# EAGLE design Qwiic_IMU_Bonobo (EAGLE 7.7.0)
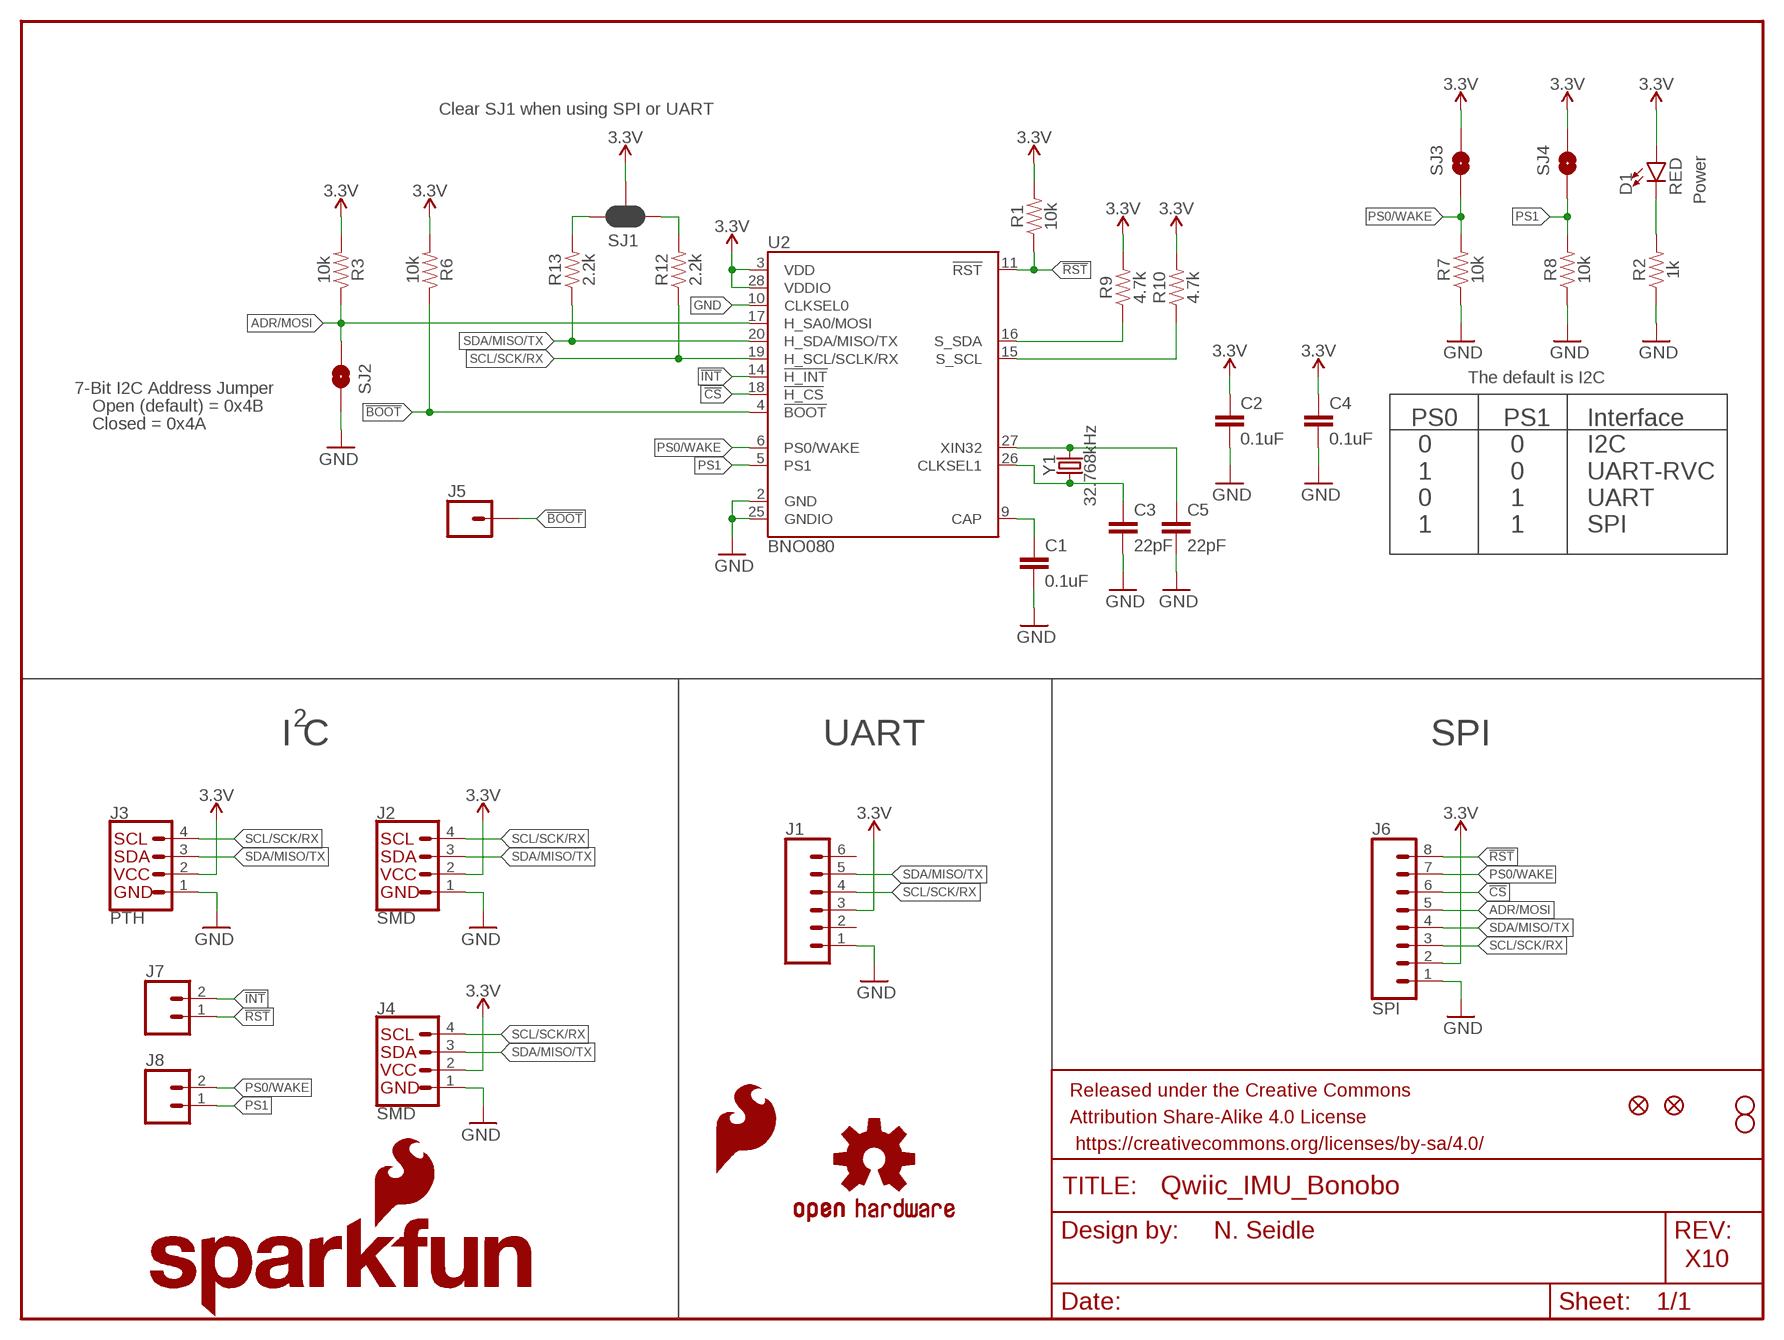
[diagram p0: schematic, sheet 1]

## Parts
C1  0.1uF  0.1UF-0603-25V-(+80/-20%)  [0603]
C2  0.1uF  0.1UF-0603-25V-(+80/-20%)  [0603]
C3  22pF  22PF-0603-50V-5%  [0603]
C4  0.1uF  0.1UF-0603-25V-(+80/-20%)  [0603]
C5  22pF  22PF-0603-50V-5%  [0603]
D1  RED  LED-RED0603  [LED-0603]
FRAME1  FRAME-LETTER  [CREATIVE_COMMONS]
J1  CONN_06NO_SILK_FEMALE_PTH  [1X06_NO_SILK]
J2  SMD  I2C_STANDARDJS-1MM  [1X04_1MM_RA]
J3  PTH  I2C_STANDARD_NO_SILK  [1X04_NO_SILK]
J4  SMD  I2C_STANDARDJS-1MM  [1X04_1MM_RA]
J5  CONN_01PTH_NO_SILK_YES_STOP  [1X01_NO_SILK]
J6  SPI  CONN_08NO_SILK_FEMALE_PTH  [1X08_NO_SILK]
J7  CONN_021X02_NO_SILK  [1X02_NO_SILK]
J8  CONN_021X02_NO_SILK  [1X02_NO_SILK]
JP2  FIDUCIALUFIDUCIAL  [MICRO-FIDUCIAL]
JP3  STAND-OFF  [STAND-OFF]
JP4  STAND-OFF  [STAND-OFF]
JP6  FIDUCIALUFIDUCIAL  [MICRO-FIDUCIAL]
LOGO1  OSHW-LOGOMINI  [OSHW-LOGO-MINI]
LOGO4  SFE_LOGO_FLAME.1_INCH  [SFE_LOGO_FLAME_.1]
LOGO5  SFE_LOGO_NAME_FLAME.1_INCH  [SFE_LOGO_NAME_FLAME_.1]
R1  10k  10KOHM-0603-1/10W-1%  [0603]
R2  1k  1KOHM-0603-1/10W-1%  [0603]
R3  10k  10KOHM-0603-1/10W-1%  [0603]
R6  10k  10KOHM-0603-1/10W-1%  [0603]
R7  10k  10KOHM-0603-1/10W-1%  [0603]
R8  10k  10KOHM-0603-1/10W-1%  [0603]
R9  4.7k  4.7KOHM-0603-1/10W-1%  [0603]
R10  4.7k  4.7KOHM-0603-1/10W-1%  [0603]
R12  2.2k  2.2KOHM-0603-1/10W-1%  [0603]
R13  2.2k  2.2KOHM-0603-1/10W-1%  [0603]
SJ1  JUMPER-SMT_3_2-NC_PASTE_SILK  [SMT-JUMPER_3_2-NC_PASTE_SILK]
SJ2  SOLDERJUMPERNO  [SJ_2S-NO]
SJ3  SOLDERJUMPERNO  [SJ_2S-NO]
SJ4  SOLDERJUMPERNO  [SJ_2S-NO]
U2  BNO080  [LGA-28]
Y1  32.768kHz  CRYSTAL-32.768KHZSMD-3.2X1.5  [CRYSTAL-SMD-3.2X1.5MM]

## Nets
3.3V: C2.1 C4.1 D1.A J1.3 J2.2(VCC) J3.2(VCC) J4.2(VCC) J6.2 R1.2 R3.2 R6.2 R9.2 R10.2 SJ1.2 SJ3.1 SJ4.1 U2.3(VDD) U2.28(VDDIO)
!BOOT: J5.1 R6.1 U2.4(!BOOT)
!CS: J6.6 U2.18(!H_CS)
!INT: J7.2 U2.14(!H_INT)
!RST: J6.8 J7.1 R1.1 U2.11(!RST)
ADR/MOSI: J6.5 R3.1 SJ2.2 U2.17(H_SA0/MOSI)
CAP: C1.1 U2.9(CAP)
GND: C1.2 C2.2 C3.2 C4.2 C5.2 J1.1 J2.1(GND) J3.1(GND) J4.1(GND) J6.1 R2.1 R7.1 R8.1 SJ2.1 U2.2(GND) U2.10(CLKSEL0) U2.25(GNDIO)
N$1: C5.1 U2.27(XIN32) Y1.P$2
N$2: C3.1 U2.26(CLKSEL1) Y1.P$1
N$3: D1.C R2.2
PS0/WAKE: J6.7 J8.2 R7.2 SJ3.2 U2.6(PS0/WAKE)
PS1: J8.1 R8.2 SJ4.2 U2.5(PS1)
S_SCL: R10.1 U2.15(S_SCL)
S_SDA: R9.1 U2.16(S_SDA)
SCL/SCK/RX: J1.4 J2.4(SCL) J3.4(SCL) J4.4(SCL) J6.3 R12.1 U2.19(H_SCL/SCLK/RX)
SCL_PU: R12.2 SJ1.1
SDA/MISO/TX: J1.5 J2.3(SDA) J3.3(SDA) J4.3(SDA) J6.4 R13.1 U2.20(H_SDA/MISO/TX)
SDA_PU: R13.2 SJ1.3
Unconnected: J1.2 J1.6

## Notes on the sheet
- Clear SJ1 when using SPI or UART
- Power
- The default is I2C
- 7-Bit I2C Address Jumper
- Open (default) = 0x4B
- Closed = 0x4A
- PS0
   0
   1
   0
   1
- PS1
   0
   0
   1
   1
- Interface
  I2C
  UART-RVC
  UART
  SPI
- 2
- I C | UART | SPI
- N. Seidle
- X10

## Library data of the parts
C1 C2 C4 = SparkFun-Capacitors:0.1UF: 0.1µF ceramic capacitors A capacitor is a passive two-terminal electrical component used to store electrical energy temporarily in an electric field.; PROD_ID: CAP-00810
C3 C5 = SparkFun-Capacitors:22PF: 22pF ceramic capacitors A capacitor is a passive two-terminal electrical component used to store electrical energy temporarily in an electric field.; PROD_ID: CAP-07876
D1 = SparkFun-LED:LED-RED: Red SMD LED Used in manufacturing of most products at SparkFun Packages: 0603 - SMD 0603 package [Product Link] <http://docs.avagotech.com/docs/AV02-0551EN> 0603 SMART - SMD 0603 SMART package ( more efficient and expensive)[Product Link] <http://www.osram-os.com/Graphics/XPic2/00077099_0.pdf> 1206 - SMD1206 package [Product Link] <https://www.sparkfun.com/datasheets/DevTools/LilyPad/Q150OVS4.pdff> SparkFun Products: Pro Mini 328 -5V <https://www.sparkfun.com/products/821> RedBoard <https://www.sparkfun.com/products/12757> IOIO-OTG <https://www.sparkfun.com/products/13613>; PROD_ID: DIO-00819
FRAME1 = SparkFun-Aesthetics:FRAME-LETTER: Schematic Frame - Letter Standard 8.5x11 US Letter frame
J1 = SparkFun-Connectors:CONN_06: Multi connection point. Often used as Generic Header-pin footprint for 0.1 inch spaced/style header connections On any of the 0.1 inch spaced packages, you can populate with these: Break Away Headers - Straight <https://www.sparkfun.com/products/116> (PRT-00116) Break Away Male Headers - Right Angle <https://www.sparkfun.com/products/553> (PRT-00553) Female Headers <https://www.sparkfun.com/products/115> (PRT-00115) Break Away Headers - Machine Pin <https://www.sparkfun.com/products/117> (PRT-00117) Break Away Female Headers - Swiss Machine Pin <https://www.sparkfun.com/products/743> (PRT-00743) Arduino Stackable Header - 6 Pin <https://www.sparkfun.com/products/9280> (PRT-09280) For SCREWTERMINALS and SPRING TERMINALS visit here: Screw Terimnals on SparkFun.com <https://www.sparkfun.com/search/results?term=Screw+Terminals> (5mm/3.5mm/2.54mm spacing) This device is also useful as a general connection point to wire up your design to another part of your project. Our various solder wires solder well into these plated through hole pads. Hook-Up Wire - Assortment (Stranded, 22 AWG) <https://www.sparkfun.com/products/11375> (PRT-11375) Hook-Up Wire - Assortment (Solid Core, 22 AWG) <https://www.sparkfun.com/products/11367> (PRT-11367) View the entire wire category on our website here <https://www.sparkfun.com/categories/141>; PROD_ID: CONN-08437
J2-J4 = SparkX:I2C_STANDARD: SparkFun I2C Standard Pinout Header SparkFun has standardized on a pinout for all I2C based sensor breakouts. This pinout allows I2C boards to be plugged directly into the headers on Arduino Uno compatible boards, and to be daisy chained easily. Example SparkFun Products: SparkFun Atmospheric Sensor Breakout - BME280 <https://www.sparkfun.com/products/13676> SparkFun Altitude/Pressure Sensor Breakout - MPL3115A2 <https://www.sparkfun.com/products/11084> SparkFun TOF Range Finder Sensor - VL6180 <https://www.sparkfun.com/products/12785>
J5 = SparkFun-Connectors:CONN_01: Single connection point. Often used as Generic Header-pin footprint for 0.1 inch spaced/style header connections On any of the 0.1 inch spaced packages, you can populate with these: Break Away Headers - Straight <https://www.sparkfun.com/products/116> (PRT-00116) Break Away Male Headers - Right Angle <https://www.sparkfun.com/products/553> (PRT-00553) Female Headers <https://www.sparkfun.com/products/115> (PRT-00115) Break Away Headers - Machine Pin <https://www.sparkfun.com/products/117> (PRT-00117) Break Away Female Headers - Swiss Machine Pin <https://www.sparkfun.com/products/743> (PRT-00743) This device is also useful as a general connection point to wire up your design to another part of your project. Our various solder wires solder well into these plated through hole pads. Hook-Up Wire - Assortment (Stranded, 22 AWG) <https://www.sparkfun.com/products/11375> (PRT-11375) Hook-Up Wire - Assortment (Solid Core, 22 AWG) <https://www.sparkfun.com/products/11367> (PRT-11367) View the entire wire category on our website here <https://www.sparkfun.com/categories/141> Special notes: SMTSO-256-ET is a "flush mount" nut for a 4-40 screw. We mostly use this on specialty testbeds; it is a nice way to connect hardware to your PCB at an adjustable hieght. Also note, the SNAP packages are for using a snappable style connector. We sell a baggie of snaps and they are also used on two LilyPad designs: Snap Assortment - 30 pack (male and female) <https://www.sparkfun.com/products/11347> (DEV-11347) LilyPad Arduino SimpleSnap <https://www.sparkfun.com/products/10941> (DEV-10941) LilyPad SimpleSnap Protoboard <https://www.sparkfun.com/products/10940> (DEV-10940)
J6 = SparkFun-Connectors:CONN_08: Multi connection point. Often used as Generic Header-pin footprint for 0.1 inch spaced/style header connections On any of the 0.1 inch spaced packages, you can populate with these: Break Away Headers - Straight <https://www.sparkfun.com/products/116> (PRT-00116) Break Away Male Headers - Right Angle <https://www.sparkfun.com/products/553> (PRT-00553) Female Headers <https://www.sparkfun.com/products/115> (PRT-00115) Break Away Headers - Machine Pin <https://www.sparkfun.com/products/117> (PRT-00117) Break Away Female Headers - Swiss Machine Pin <https://www.sparkfun.com/products/743> (PRT-00743) Arduino Stackable Header - 8 Pin <https://www.sparkfun.com/products/9279> (PRT-09279) For SCREWTERMINALS and SPRING TERMINALS visit here: Screw Terimnals on SparkFun.com <https://www.sparkfun.com/search/results?term=Screw+Terminals> (5mm/3.5mm/2.54mm spacing) This device is also useful as a general connection point to wire up your design to another part of your project. Our various solder wires solder well into these plated through hole pads. Hook-Up Wire - Assortment (Stranded, 22 AWG) <https://www.sparkfun.com/products/11375> (PRT-11375) Hook-Up Wire - Assortment (Solid Core, 22 AWG) <https://www.sparkfun.com/products/11367> (PRT-11367) View the entire wire category on our website here <https://www.sparkfun.com/categories/141> Special notes: Molex polarized connector foot print use with SKU : PRT-08231 with associated crimp pins and housings. 1MM SMD Version SKU: PRT-10208 NOTES ON THE VARIANTS LOCK and LOCK_LONGPADS... This footprint was designed to help hold the alignment of a through-hole component (i.e. 6-pin header) while soldering it into place. You may notice that each hole has been shifted either up or down by 0.005 of an inch from it's more standard position (which is a perfectly straight line). This slight alteration caused the pins (the squares in the middle) to touch the edges of the holes. Because they are alternating, it causes a "brace" to hold the component in place. 0.005 has proven to be the perfect amount of "off-center" position when using our standard breakaway headers. Although looks a little odd when you look at the bare footprint, once you have a header in there, the alteration is very hard to notice. Also,if you push a header all the way into place, it is covered up entirely on the bottom side.; PROD_ID: CONN-08438
J7 J8 = SparkFun-Connectors:CONN_02: Multi connection point. Often used as Generic Header-pin footprint for 0.1 inch spaced/style header connections On any of the 0.1 inch spaced packages, you can populate with these: Break Away Headers - Straight <https://www.sparkfun.com/products/116> (PRT-00116) Break Away Male Headers - Right Angle <https://www.sparkfun.com/products/553> (PRT-00553) Female Headers <https://www.sparkfun.com/products/115> (PRT-00115) Break Away Headers - Machine Pin <https://www.sparkfun.com/products/117> (PRT-00117) Break Away Female Headers - Swiss Machine Pin <https://www.sparkfun.com/products/743> (PRT-00743) For SCREWTERMINALS and SPRING TERMINALS visit here: Screw Terimnals on SparkFun.com <https://www.sparkfun.com/search/results?term=Screw+Terminals> (5mm/3.5mm/2.54mm spacing) This device is also useful as a general connection point to wire up your design to another part of your project. Our various solder wires solder well into these plated through hole pads. Hook-Up Wire - Assortment (Stranded, 22 AWG) <https://www.sparkfun.com/products/11375> (PRT-11375) Hook-Up Wire - Assortment (Solid Core, 22 AWG) <https://www.sparkfun.com/products/11367> (PRT-11367) View the entire wire category on our website here <https://www.sparkfun.com/categories/141> Special notes: Molex polarized connector foot print use with: PRT-08233 with associated crimp pins and housings. 2.54_SCREWTERM for use with PRT-10571. 3.5mm Screw Terminal footprints for PRT-08084 5mm Screw Terminal footprints for use with PRT-08432
JP2 JP6 = SparkFun:FIDUCIAL: Fiducial Alignment Points Various fiducial points for machine vision alignment.
JP3 JP4 = SparkFun:STAND-OFF: Stand Off This is the mechanical footprint for a #4 phillips button head screw. Use the keepout ring to avoid running the screw head into surrounding components. SKU : PRT-00447
LOGO1 = SparkFun-Aesthetics:OSHW-LOGO: Open-Source Hardware (OSHW) Logo This logo indicates the piece of hardware it is found on incorporates a OSHW license and/or adheres to the definition of open source hardware found here: http://freedomdefined.org/OSHW
LOGO4 = SparkFun-Aesthetics:SFE_LOGO_FLAME: SparkFun Flame Logo This is the SparkFun flame logo. The logo on the schematic will always be the same size; the package variant is the height of the flame. Default layer for the logo on the board is tSilk.
LOGO5 = SparkFun-Aesthetics:SFE_LOGO_NAME_FLAME: SparkFun Font Logo w/ Flame This is the SparkFun full logo. The logo on the schematic will always be the same size; the package variant is the height of the flame part of the logo. Default layer for the logo on the board is tSilk.
R1 R3 R6-R8 = SparkFun-Resistors:10KOHM: 10kΩ resistor A resistor is a passive two-terminal electrical component that implements electrical resistance as a circuit element. Resistors act to reduce current flow, and, at the same time, act to lower voltage levels within circuits. - Wikipedia; PROD_ID: RES-00824
R2 = SparkFun-Resistors:1KOHM: 1kΩ resistor A resistor is a passive two-terminal electrical component that implements electrical resistance as a circuit element. Resistors act to reduce current flow, and, at the same time, act to lower voltage levels within circuits. - Wikipedia; PROD_ID: RES-07856
R9 R10 = SparkFun-Resistors:4.7KOHM: 4.7kΩ resistor A resistor is a passive two-terminal electrical component that implements electrical resistance as a circuit element. Resistors act to reduce current flow, and, at the same time, act to lower voltage levels within circuits. - Wikipedia; PROD_ID: RES-07857
R12 R13 = SparkFun-Resistors:2.2KOHM: 2.2kΩ resistor A resistor is a passive two-terminal electrical component that implements electrical resistance as a circuit element. Resistors act to reduce current flow, and, at the same time, act to lower voltage levels within circuits. - Wikipedia; PROD_ID: RES-08272
SJ1 = SparkFun-Jumpers:JUMPER-SMT_3_2-NC_PASTE: Normally closed solder jumper (2 of 2 connections) This jumper has an aperture in the stencil to allow solder paste to bridge both connections. Both connections are normally closed (NC). Wick off the solder to open the connection(s). Reapply solder to reclose the connection(s).
SJ2-SJ4 = SparkFun:SOLDERJUMPER: Solder Jumper Standard SMD solder jumper. Used to automate production. Two varients : Normally Open and Normally Closed are the same, but have different paste layers. NC will have a large amount of paste and should jumper during reflow.
U2 = BNO080:BNO080
Y1 = SparkFun-Clocks:CRYSTAL-32.768KHZ: 32.768kHz Crystal Frequency: 32.768kHz Frequency Stability: ±20ppm Load Capacitance: 12.5pF (PTH-2X6 & SMD-3.2X1.5), 6pF (SMD-2X6) SparkFun Products: SparkFun BigTime Watch Kit <https://www.sparkfun.com/products/11734> SparkFun nRF52832 Breakout <https://www.sparkfun.com/products/13990> SparkFun Real Time Clock Module <https://www.sparkfun.com/products/12708>; PROD_ID: XTAL-13062

## Board
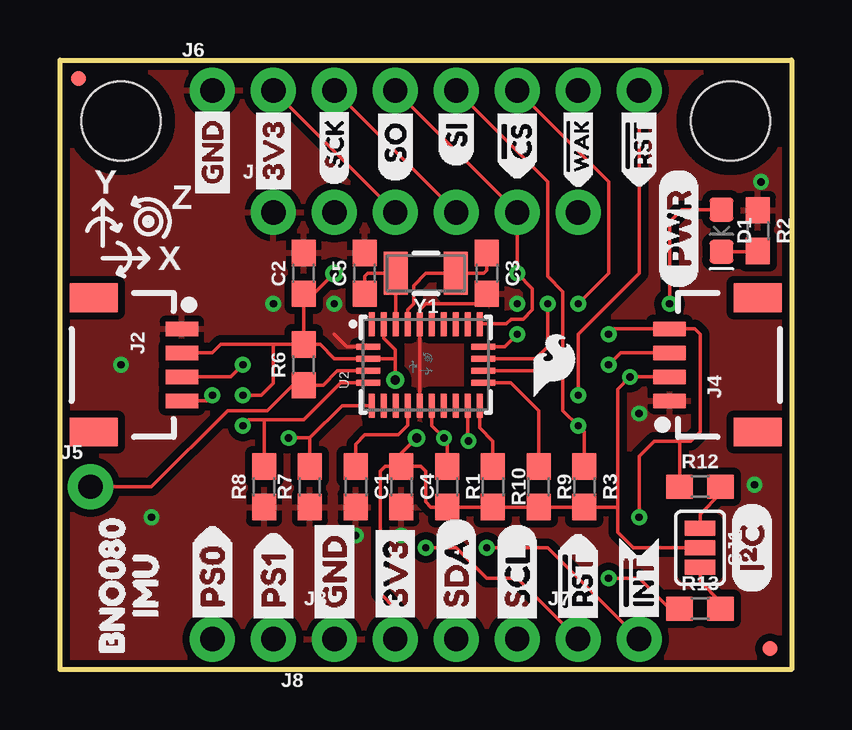
[diagram p1: board, top side]
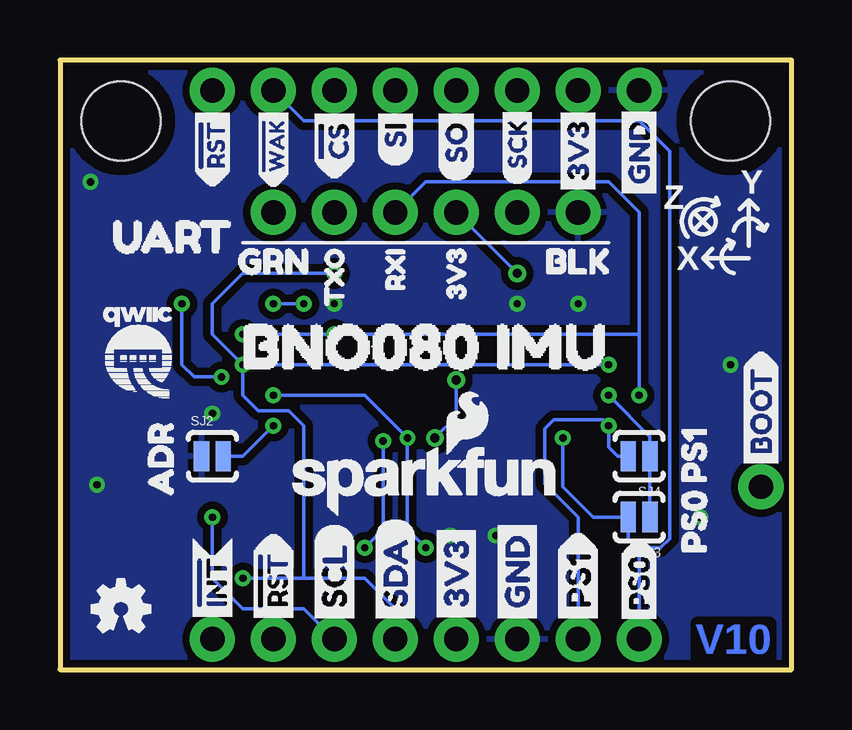
[diagram p2: board, bottom side, seen from below]

Size 30.48 x 25.4 mm. Coordinates in mm from the lower left corner, seen from the top.
Outline: 0,0 0,25.4 30.48,25.4 30.48,0 0,0
Copper layers (1*16): Top 0.035mm / dielectric 1.5mm / Bottom 0.035mm
Design rules "SparkFun-2-layer-PCBWay-LIMIT": minimum track width 6mil, minimum drill 12mil, track to track 6mil, track to pad 6mil, pad to pad 6mil, via to via 6mil, smd to smd 6mil, copper to edge 6mil, drill to drill 6mil, minimum pad ring 7mil, minimum via ring 7mil, stop-mask expansion 4mil, vias tented up to drill 25mil, thermal gap 10mil

### Footprints (pad centres in the part's own frame; a part is rotated, then mirrored left to right if it is on the bottom)
0603 = smd 1.1 x 1: 1 -0.85,0; 2 0.85,0
LED-0603 = smd 1 x 1: A -0.877,0; C 0.877,0
1X06_NO_SILK = drill 1.016 pad 1.88: 1 0,0; 2 2.54,0; 3 5.08,0; 4 7.62,0; 5 10.16,0; 6 12.7,0
1X04_1MM_RA = smd 0.6 x 1.35: 1 -1.5,0; 2 -0.5,0; 3 0.5,0; 4 1.5,0 | smd 1.2 x 2: NC1 2.8,-3.675; NC2 -2.8,-3.675
1X04_NO_SILK = drill 1.016 pad 1.88: 1 0,0; 2 2.54,0; 3 5.08,0; 4 7.62,0
1X01_NO_SILK = drill 1.016 pad 1.88: 1 0,0
1X08_NO_SILK = drill 1.016 pad 1.88: 1 0,0; 2 2.54,0; 3 5.08,0; 4 7.62,0; 5 10.16,0; 6 12.7,0; 7 15.24,0; 8 17.78,0
1X02_NO_SILK = drill 1.016 pad 1.88: 1 0,0; 2 2.54,0
MICRO-FIDUCIAL = smd 0.635 x 0.635: 1 0,0
STAND-OFF = hole 3.302: 0,0
SMT-JUMPER_3_2-NC_PASTE_SILK = smd 0.635 x 1.27: 1 -0.813,0; 2 0,0; 3 0.813,0
SJ_2S-NO = smd 0.635 x 1.27: 1 -0.45,0; 2 0.45,0
LGA-28 = smd 1 x 0.25: 1 1.7,2.25; 6 -1.7,2.25; 7 -1.7,1.75; 8 -1.7,1.25; 9 -1.7,0.75; 10 -1.7,0.25; 11 -1.7,-0.25; 12 -1.7,-0.75; 13 -1.7,-1.25; 14 -1.7,-1.75; 15 -1.7,-2.25; 20 1.7,-2.25; 21 1.7,-1.75; 22 1.7,-1.25; 23 1.7,-0.75; 24 1.7,-0.25; 25 1.7,0.25; 26 1.7,0.75; 27 1.7,1.25; 28 1.7,1.75 | smd 0.25 x 1: 2 0.75,2.4; 3 0.25,2.4; 4 -0.25,2.4; 5 -0.75,2.4; 16 -0.75,-2.4; 17 -0.25,-2.4; 18 0.25,-2.4; 19 0.75,-2.4
CRYSTAL-SMD-3.2X1.5MM = smd 1 x 1.8: P$1 -1.25,0; P$2 1.25,0

### Placement (x,y rotation side)
C1  12.32,7.62 270 top
C2  10.16,16.51 90 top
C3  17.78,16.51 270 top
C4  14.22,7.62 270 top
C5  12.7,16.51 90 top
D1  27.56,18.29 270 top
FRAME1  -20.32,-17.78 0 top  (outside the outline)
J1  8.89,19.05 0 top
J2  5.08,12.7 270 top
J3  11.43,1.27 0 top
J4  25.4,12.7 90 top
J5  1.27,7.62 0 top
J6  6.35,24.13 0 top
J7  21.59,1.27 0 top
J8  8.89,1.27 180 top
JP2  29.59,0.89 0 top
JP3  2.54,22.86 0 top
JP4  27.94,22.86 0 top
JP6  0.76,24.64 0 top
LOGO1  27.94,2.54 0 bottom
LOGO4  19.43,11.05 0 top
LOGO5  21.21,6.35 0 bottom
R1  16.13,7.62 270 top
R2  29.08,18.29 270 top
R3  21.84,7.62 270 top
R6  10.16,12.7 90 top
R7  10.41,7.62 90 top
R8  8.51,7.62 90 top
R9  19.94,7.62 270 top
R10  18.03,7.62 270 top
R12  26.67,7.62 0 top
R13  26.67,2.54 0 top
SJ1  26.67,5.08 270 top
SJ2  24.13,8.89 0 bottom
SJ3  6.35,6.35 180 bottom
SJ4  6.35,8.89 180 bottom
U2  15.24,12.7 90 top
U$1  [(PWR)]  25.78,15.88 90 top
U$2  [BOOT2]  1.27,8.13 90 bottom
U$3  [#RST>]  21.59,1.52 90 top
U$4  [#RST>]  21.59,1.52 90 bottom
U$5  [SCL]  19.05,1.65 90 bottom
U$6  [SCL]  19.05,1.65 90 top
U$7  [SDA]  16.51,1.65 90 top
U$8  [SDA]  16.51,1.65 90 bottom
U$9  [3V3]  13.97,1.65 90 bottom
U$10  [3V3]  13.97,1.65 90 top
U$11  [3V30]  8.89,19.56 90 bottom
U$12  [SCK0]  11.43,20.19 90 top
U$13  [SCK0]  11.43,20.19 90 bottom
U$14  [PS03]  6.35,1.65 90 bottom
U$15  [GND]  11.43,1.65 90 top
U$16  [GND]  11.43,1.65 90 bottom
U$17  [SI1]  16.51,20.95 90 top
U$18  [SI1]  16.51,20.95 90 bottom
U$19  [#WAK6]  21.59,19.94 90 top
U$20  [#WAK6]  21.59,19.94 90 bottom
U$21  [3V32]  13.97,14.73 90 bottom
U$22  [RXI1]  16.51,15.11 90 bottom
U$23  [(I_SUPER2_C)]  28.83,3.17 90 top
U$25  [#INT0]  24.13,1.52 90 top
U$26  [#INT0]  24.13,1.52 90 bottom
U$27  [PS14]  8.89,1.65 90 bottom
U$28  [PS14]  8.89,1.65 90 top
U$29  [PS05]  6.35,1.65 90 top
U$30  [ADR0]  26.29,6.35 90 bottom
U$33  [PS114]  4.06,6.86 90 bottom
U$34  [PS015]  4.06,3.94 90 bottom
U$35  [TXO0]  19.05,14.48 90 bottom
U$39  [UART8]  29.46,18.03 0 bottom
U$40  [GRN10]  24.13,17.02 0 bottom
U$41  [BLK9]  11.18,17.02 0 bottom
U$42  [GND1]  6.35,19.43 90 bottom
U$43  [GND1]  6.35,19.43 90 top
U$44  [BNO080_IMU11]  24.51,13.46 0 bottom
U$46  [BNO08012]  2.16,-0.25 90 top
U$47  [IMU13]  3.56,1.27 90 top
U$49  [#RST7]  24.13,19.94 90 bottom
U$50  [3V30]  8.89,19.56 90 top
U$51  [#RST7]  24.13,19.94 90 top
U$52  [#CS3]  19.05,20.19 90 top
U$53  [#CS3]  19.05,20.19 90 bottom
U$54  [SO0]  13.97,20.32 90 bottom
U$55  [SO0]  13.97,20.32 90 top
U$59  [QWIIC#LABEL#FULL#M#PNG]  27.3,13.21 0 bottom
Y1  15.24,16.51 180 top

### Tracks (layer width: path | path; a pad name or v marks a point on that pad's centre or on a via)
3.3V  (via drill 0.3, 0.38)
  Top 0.152: U2.3 11.43,12.95 10.83,13.55 R6.2 | U2.28 13.49,13.81 13.97,13.34 13.97,12.95 | U2.3 | R6.2 8.89,13.55 | 8.89,13.55 6.69,13.55 6.35,13.21 J2.2 | J3.2 13.97,2.54 13.34,3.17 13.34,8.26 13.55,8.47 C4.1 | J4.2 v23.76,12.2 v23.75,12.19 23.24,11.68 23.24,6.73 | 23.24,6.73 23.24,5.71 23.88,5.08 SJ1.2 | 23.24,6.73 23.2,6.77 R3.2 R9.2 R10.2 R1.2 15.46,6.77 15.24,6.99 15.24,8.26 15.03,8.47 C4.1 | v7.62,11.43 8.38,11.43 8.89,11.94 8.89,13.55 | J6.2 J1.3 | R6.2 C2.1 10.58,15.66 v11.43,16.51 | C4.1 14.22,9.02 v14.86,9.65 | 13.97,12.95 v13.97,12.06 | U2.3 13.97,12.95 | D1.A 25.9,19.16 25.4,18.67 v25.4,15.24
  Bottom 0.152: SJ3.1 SJ4.1 5.9,9.71 v7.62,11.43 | J1.3 v11.43,16.51 | v14.86,9.65 13.97,10.54 v13.97,12.06 | v23.75,12.19 24.89,12.19 25.4,12.7 v25.4,15.24
!BOOT
  Top 0.152: U2.4 11.56,12.45 10.96,11.85 R6.1 9.69,11.85 8.64,10.79 6.99,10.79 3.81,7.62 J5.1
!CS  (via drill 0.3)
  Top 0.152: v21.59,15.24 22.86,16.51 22.86,20.32 J6.6 | U2.18 19.81,12.95 20.32,13.46 v20.32,15.24
  Bottom 0.152: v21.59,15.24 v20.32,15.24
!INT  (via drill 0.3)
  Top 0.152: U2.14 16.99,9.55 v17.02,9.53 | v17.78,5.08 20.32,5.08 J7.2
  Bottom 0.152: v17.02,9.53 17.02,5.84 v17.78,5.08
!RST  (via drill 0.3)
  Top 0.152: U2.11 15.49,10.16 v16,9.65 16.13,9.53 R1.1 | J6.8 24.13,16.51 21.59,13.97 v21.59,11.43 | v15.24,5.08 16.51,5.08 17.78,3.81 19.05,3.81 J7.1
  Bottom 0.152: v15.24,5.08 16,5.84 v16,9.65 17.78,11.43 v21.59,11.43
ADR/MOSI  (via drill 0.3)
  Top 0.152: 20.95,12.45 20.95,15.75 20.32,16.38 20.32,20.32 J6.5 | 20.95,12.45 20.95,10.79 v21.59,10.16 21.84,9.91 R3.1 | U2.17 20.95,12.45
  Bottom 0.152: SJ2.2 22.86,8.89 v21.59,10.16
CAP
  Top 0.152: U2.9 14.49,10.17 14.1,9.78 12.7,9.78 12.32,9.4 C1.1
GND  (via drill 0.3)
  Top 0.152: U2.2 11.95,13.45 11.43,13.97 | C3.2 17.36,15.24 15.24,15.24 14.99,14.99 U2.25 U2.10
  other vias: 24.13,10.67 14.22,5.59 12.32,5.59 2.54,12.7 28.94,7.7 3.81,6.35 8.89,15.24 19.05,15.24 11.43,15.24 29.21,20.32
  pour Bottom (isolate 0.305): 0,0 0,25.4 30.48,25.4 30.48,0
  pour Top (isolate 0.305): 0,0 0,25.4 30.48,25.4 30.48,0
N$1
  Top 0.152: U2.27 Y1.P$2 12.83,16.51 12.7,16.38 C5.1
N$2
  Top 0.152: C3.1 17.78,16.64 17.65,16.51 Y1.P$1 15.24,16.51 14.73,16 14.73,15.24 14.49,15 U2.26
N$3
  Top 0.152: D1.C 29.06,17.41 R2.2
PS0/WAKE  (via drill 0.3)
  Top 0.152: U2.6 11.76,11 10.41,9.65 | 10.41,9.65 R7.2 | 10.41,9.65 v9.53,9.65
  Bottom 0.152: v9.53,9.65 9.53,7.62 8.26,6.35 SJ3.2 6.8,5.4 6.48,5.08 6.35,5.08 | J6.7 20.32,22.86 6.35,22.86 5.08,21.59 5.08,5.46 5.46,5.08 6.35,5.08 | J8.2 6.35,5.08
PS1  (via drill 0.3)
  Top 0.152: U2.5 11.7,11.95 10.16,10.41 8.51,10.41 | 8.51,10.41 7.87,10.41 v7.62,10.16 | R8.2 8.51,10.41
  Bottom 0.152: SJ4.2 7.24,8.89 7.62,9.27 v7.62,10.16 7.87,10.41 9.91,10.41 10.29,10.03 10.29,7.75 8.89,6.35 J8.1
S_SCL
  Top 0.152: U2.15 17.49,10.07 18.03,9.53 R10.1
S_SDA
  Top 0.152: U2.16 18.78,11.95 19.94,10.79 R9.1
SCL/SCK/RX  (via drill 0.3)
  Top 0.152: U2.19 18.53,13.45 v19.05,13.97 | v22.86,13.97 23.09,14.2 J4.4 26.44,14.2 26.67,13.97 26.67,9.91 26.29,9.53 25.78,9.53 | J2.4 6.12,11.2 v6.35,11.43 | 25.78,9.53 24.77,9.53 24.13,8.89 v24.13,6.35 | J6.3 J1.4 | R12.1 25.82,9.49 25.78,9.53
  Bottom 0.152: v22.86,13.97 v19.05,13.97 6.35,13.97 | J3.4 20.32,2.54 22.86,2.54 24.13,3.81 v24.13,6.35 | 6.35,13.97 6.35,19.05 7.62,20.32 15.24,20.32 J1.4 | 6.35,13.97 v6.35,11.43
SCL_PU
  Top 0.152: SJ1.1 26.67,6.48 27.52,7.33 R12.2
SDA/MISO/TX  (via drill 0.3)
  Top 0.152: J2.3 7.12,12.2 v7.62,12.7 | J4.3 23.36,13.2 v22.86,12.7 | J6.4 J1.5 v19.05,16.51 19.68,15.88 19.68,14.99 19.3,14.61 18.8,14.61 18.59,14.4 U2.20 | v22.86,3.81 24.13,3.81 25.4,2.54 R13.1
  Bottom 0.152: v19.05,16.51 22.86,16.51 24.13,15.24 24.13,13.97 v22.86,12.7 | J3.3 16.51,2.54 17.78,3.81 20.32,3.81 | v22.86,3.81 20.32,3.81 | v7.62,12.7 v22.86,12.7 | v22.86,12.7 22.86,11.43 22.23,10.79 20.95,10.79 20.32,10.16 20.32,3.81
SDA_PU
  Top 0.152: SJ1.3 26.67,3.68 27.52,2.83 R13.2

### Text on the board
Bottom: V10
tPlace: Y | Z | X
bPlace: Y | Z | X
tDocu: N. Seidle